# Altium schematic sheet 555_Timer_Schematic.SchDoc
size A3; SheetNumber: 1; SheetTotal: 1
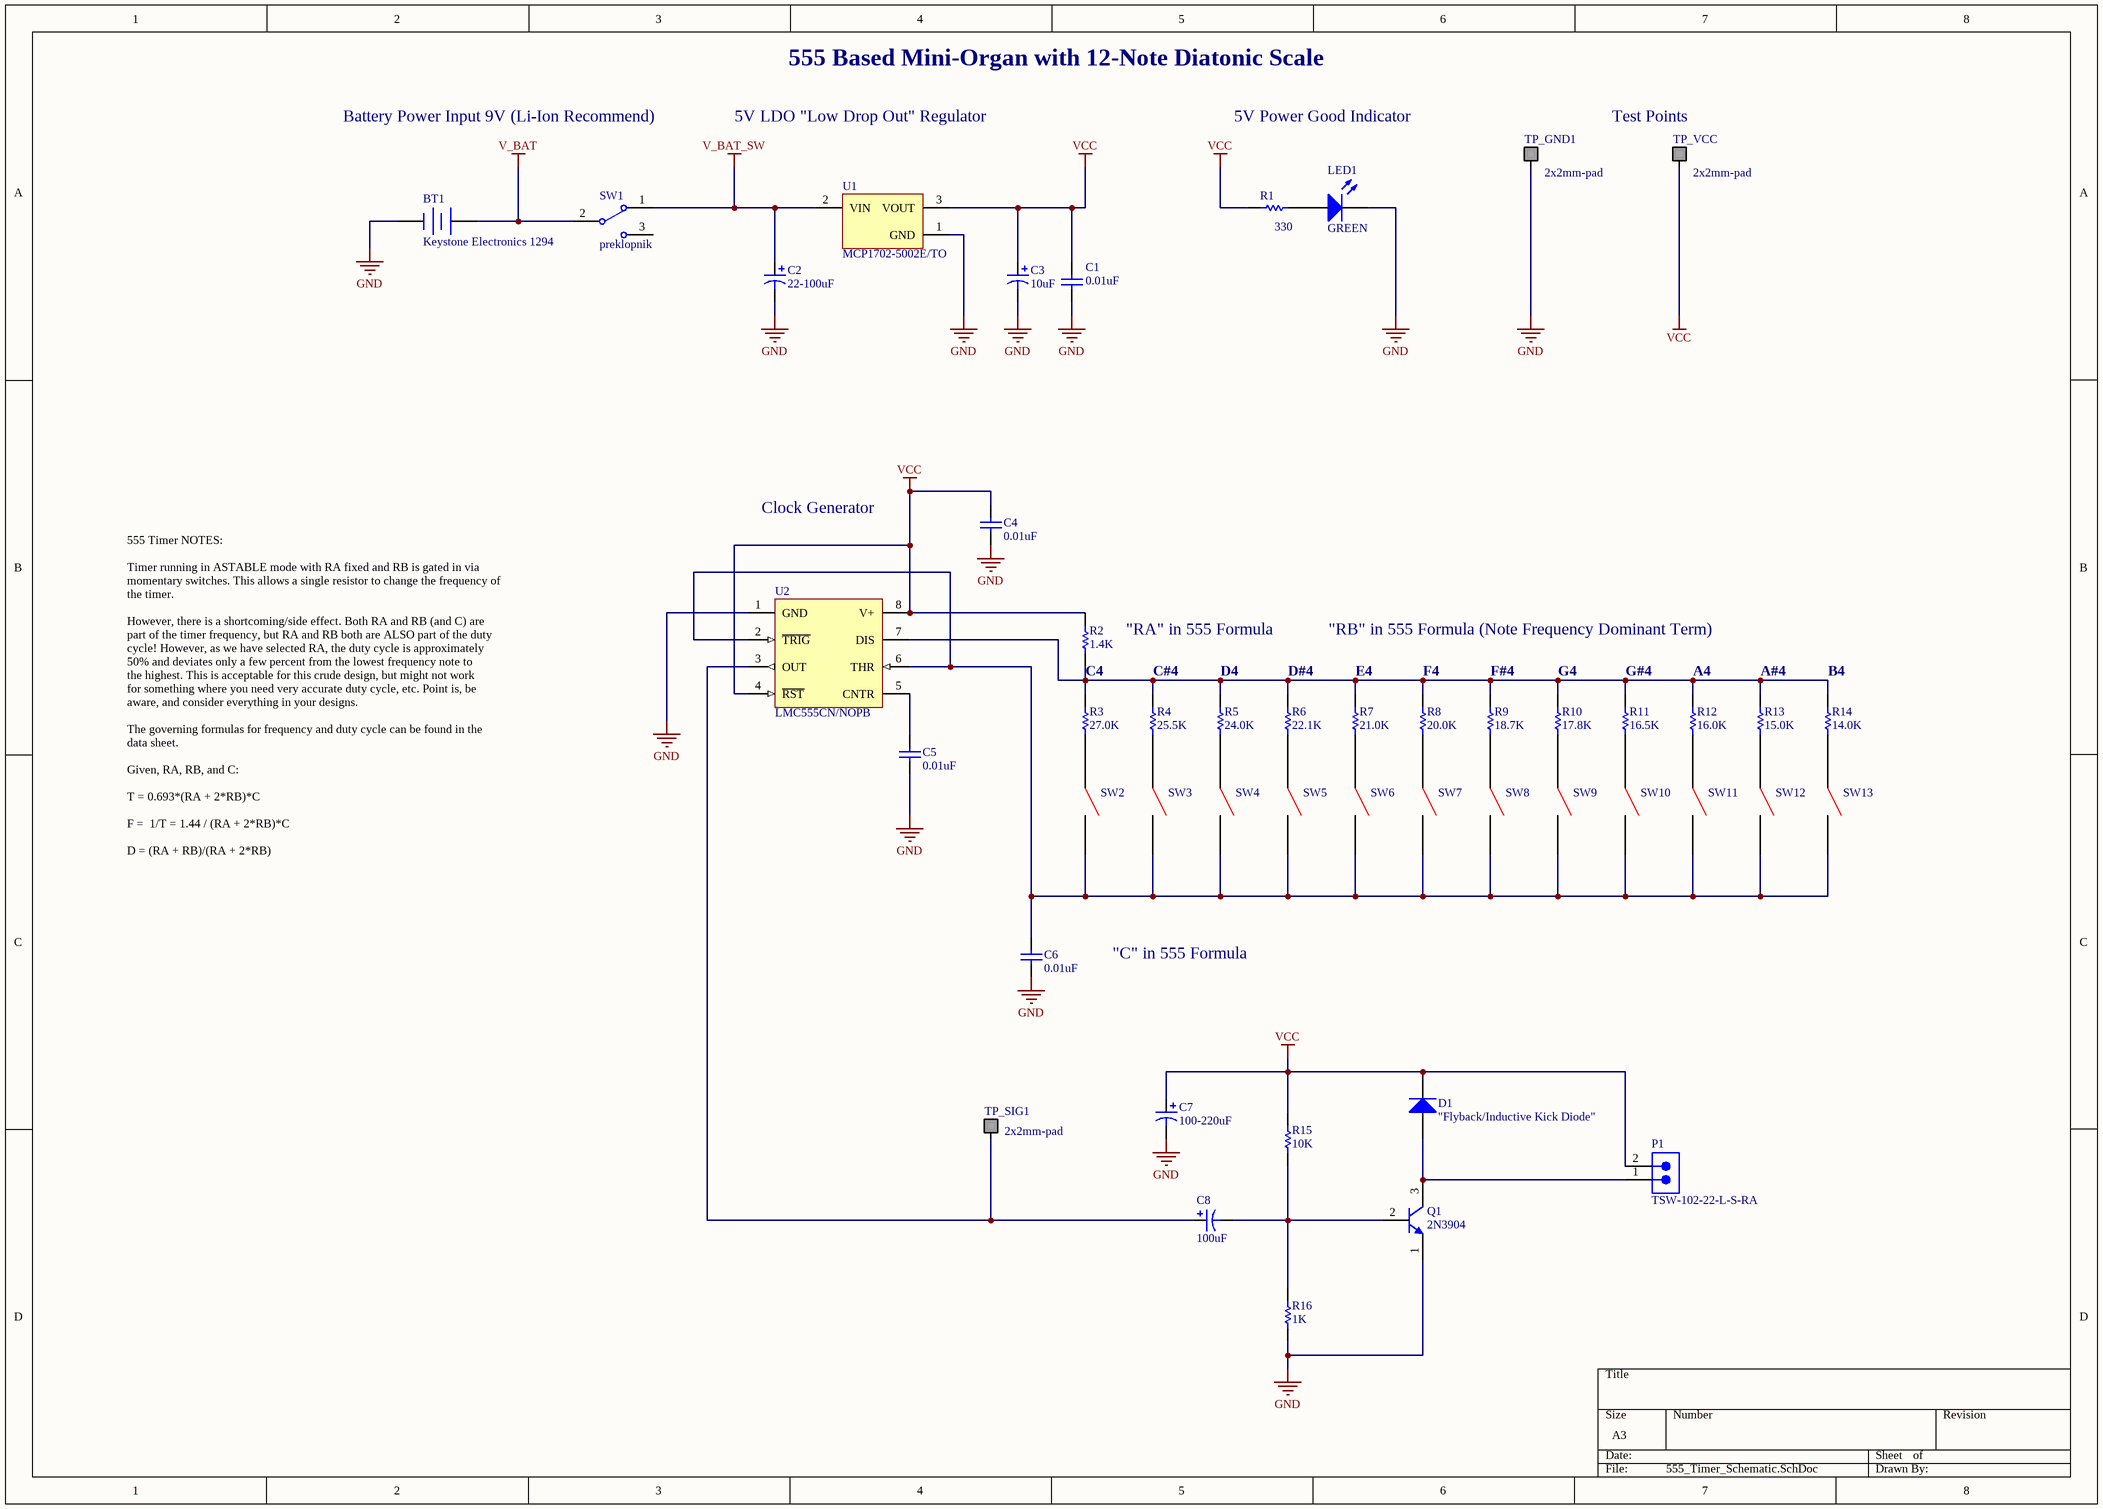
[diagram p0: 555_Timer_Schematic.SchDoc]

## Parts
BT1  Keystone Electronics 1294  [PCB-3798-1]
C1  0.01uF  [PCB-l4zci1ynknckpo24ombh-1]
C2  22-100uF  [PCB-xswzn1jk2ejoevwvaoxh-1]
C3  10uF  [PCB-xswzn1jk2ejoevwvaoxh-1]
C4  0.01uF  [PCB-l4zci1ynknckpo24ombh-1]
C5  0.01uF  [PCB-l4zci1ynknckpo24ombh-1]
C6  0.01uF  [PCB-l4zci1ynknckpo24ombh-1]
C7  100-220uF  [PCB-xswzn1jk2ejoevwvaoxh-1]
C8  100uF  [PCB-xswzn1jk2ejoevwvaoxh-1]
D1  "Flyback/Inductive Kick Diode"  [PCB-m243dhbzbg0yyf6dq86g-1]
LED1  GREEN  [PCB-teu6t62n2bsx7jl1if62-1]
P1  TSW-102-22-L-S-RA  [SMTC-TSW-102-22-X-S-RA]
Q1  2N3904  [PCB-z2fqeret6inh8n7vzy86-1]
R1  330  [PCB-bfjjg625tt0lscyu35rt-1]
R2  1.4K  [PCB-bfjjg625tt0lscyu35rt-1]
R3  27.0K  [PCB-bfjjg625tt0lscyu35rt-1]
R4  25.5K  [PCB-bfjjg625tt0lscyu35rt-1]
R5  24.0K  [PCB-bfjjg625tt0lscyu35rt-1]
R6  22.1K  [PCB-bfjjg625tt0lscyu35rt-1]
R7  21.0K  [PCB-bfjjg625tt0lscyu35rt-1]
R8  20.0K  [PCB-bfjjg625tt0lscyu35rt-1]
R9  18.7K  [PCB-bfjjg625tt0lscyu35rt-1]
R10  17.8K  [PCB-bfjjg625tt0lscyu35rt-1]
R11  16.5K  [PCB-bfjjg625tt0lscyu35rt-1]
R12  16.0K  [PCB-bfjjg625tt0lscyu35rt-1]
R13  15.0K  [PCB-bfjjg625tt0lscyu35rt-1]
R14  14.0K  [PCB-bfjjg625tt0lscyu35rt-1]
R15  10K  [PCB-bfjjg625tt0lscyu35rt-1]
R16  1K  [PCB-bfjjg625tt0lscyu35rt-1]
SW1  preklopnik  [ESWI-EG1218_V]
SW2  Panasonic EVQ-21405R  [PCB-je10m8m3eogq13l465bo-1]  (value not drawn)
SW3  Panasonic EVQ-21405R  [PCB-je10m8m3eogq13l465bo-1]  (value not drawn)
SW4  Panasonic EVQ-21405R  [PCB-je10m8m3eogq13l465bo-1]  (value not drawn)
SW5  Panasonic EVQ-21405R  [PCB-je10m8m3eogq13l465bo-1]  (value not drawn)
SW6  Panasonic EVQ-21405R  [PCB-je10m8m3eogq13l465bo-1]  (value not drawn)
SW7  Panasonic EVQ-21405R  [PCB-je10m8m3eogq13l465bo-1]  (value not drawn)
SW8  Panasonic EVQ-21405R  [PCB-je10m8m3eogq13l465bo-1]  (value not drawn)
SW9  Panasonic EVQ-21405R  [PCB-je10m8m3eogq13l465bo-1]  (value not drawn)
SW10  Panasonic EVQ-21405R  [PCB-je10m8m3eogq13l465bo-1]  (value not drawn)
SW11  Panasonic EVQ-21405R  [PCB-je10m8m3eogq13l465bo-1]  (value not drawn)
SW12  Panasonic EVQ-21405R  [PCB-je10m8m3eogq13l465bo-1]  (value not drawn)
SW13  Panasonic EVQ-21405R  [PCB-je10m8m3eogq13l465bo-1]  (value not drawn)
TP_GND1  2x2mm-pad  [PCB-iek5qk9ganu4yn12lo6h-1]
TP_SIG1  2x2mm-pad  [PCB-iek5qk9ganu4yn12lo6h-1]
TP_VCC  2x2mm-pad  [PCB-iek5qk9ganu4yn12lo6h-1]
U1  MCP1702-5002E/TO  [TO-92-TO3]
U2  LMC555CN/NOPB  [N08E]

## Nets
GND: BT1.2(-) C1.2 C2.- C3.- C4.2 C5.2 C6.2 C7.- LED1.1(K) Q1.1(E) R16.1 TP_GND1.1 U1.1(GND) U2.1(GND)
V_BAT: BT1.1(+) SW1.2(COM)
V_BAT_SW: C2.+ SW1.1 U1.2(VIN)
VCC: C1.1 C3.+ C4.1 C7.+ D1.2(K) P1.2 R1.2 R2.2 R15.2 TP_VCC.1 U1.3(VOUT) U2.4(~{RST}) U2.8(V+)
NetC5_1: C5.1 U2.5(CNTR)
NetC6_1: C6.1 SW2.2 SW3.2 SW4.2 SW5.2 SW6.2 SW7.2 SW8.2 SW9.2 SW10.2 SW11.2 SW12.2 SW13.2 U2.2(~{TRIG}) U2.6(THR)
NetC8_+: C8.+ TP_SIG1.1 U2.3(OUT)
NetC8_-: C8.- Q1.2(B) R15.1 R16.2
NetD1_1: D1.1(A) P1.1 Q1.3(C)
NetLED1_2: LED1.2(A) R1.1
NetR2_1: R2.1 R3.2 R4.2 R5.2 R6.2 R7.2 R8.2 R9.2 R10.2 R11.2 R12.2 R13.2 R14.2 U2.7(DIS)
NetR3_1: R3.1 SW2.1
NetR4_1: R4.1 SW3.1
NetR5_1: R5.1 SW4.1
NetR6_1: R6.1 SW5.1
NetR7_1: R7.1 SW6.1
NetR8_1: R8.1 SW7.1
NetR9_1: R9.1 SW8.1
NetR10_1: R10.1 SW9.1
NetR11_1: R11.1 SW10.1
NetR12_1: R12.1 SW11.1
NetR13_1: R13.1 SW12.1
NetR14_1: R14.1 SW13.1

Not connected (* = marked no-connect by the designer): SW1 3

## Notes on the sheet
- 555 Based Mini-Organ with 12-Note Diatonic Scale
- Battery Power Input 9V (Li-Ion Recommend)
- 5V LDO "Low Drop Out" Regulator
- 5V Power Good Indicator
- (near TP_VCC) Test Points
- Clock Generator
- (near R2) "RA" in 555 Formula
- "RB" in 555 Formula (Note Frequency Dominant Term)
- (near R2) C4
- (near R4) C#4
- (near R5) D4
- (near R6) D#4
- (near R7) E4
- (near R8) F4
- (near R9) F#4
- (near R10) G4
- (near R11) G#4
- (near R12) A4
- (near R13) A#4
- (near R14) B4
- 555 Timer NOTES:
  Timer running in ASTABLE mode with RA fixed and RB is gated in via momentary switches. This allows a single resistor to change the frequency of the timer.
  However, there is a shortcoming/side effect. Both RA and RB (and C) are
  part of the timer frequency, but RA and RB both are ALSO part of the duty
  cycle! However, as we have selected RA, the duty cycle is approximately
  50% and deviates only a few percent from the lowest frequency note to
  the highest. This is acceptable for this crude design, but might not work
  for something where you need very accurate duty cycle, etc. Point is, be
  aware, and consider everything in your designs.
  The governing formulas for frequency and duty cycle can be found in the
  data sheet.
  Given, RA, RB, and C:
  T = 0.693*(RA + 2*RB)*C
  F =  1/T = 1.44 / (RA + 2*RB)*C
  D = (RA + RB)/(RA + 2*RB)
- "C" in 555 Formula

## Library data of the parts
BT1 = CMP-3798-6: HOLDER BATT 9V UNIV PLASTIC PC; Manufacturer Part Number: 1294; Number of Contacts: 2; Lead-Free Status: Lead Free; Octopart Url: https://octopart.com/1294-keystone-3743; OctopartID: fd44344ed6bd2283; Material: Plastic; Contact Plating: Nickel; RoHS: Compliant; Contact Material: Steel; REACH SVHC Compliance: No SVHC; Packaging: Bulk
C1 C4-C6 = CMP-7d20b42952c2a2e7-2: Capacitor; Ceramic; Cap 0.1 uF; Tol -20, +80%; Vol-Rtg 50 VDC; Radial; Y5V; Tape & Reel; Manufacturer Part Number: K104Z15Y5VF5TL2; Lead Length: 30.0 mm; Capacitance Tolerance: +80/-20%; Lead-Free Status: Contains Lead; Capacitance: 100 nF; Voltage Rating (DC): 50.0 V; Size-Thickness: 2.60 mm; Number of Pins: 2; Packaging: Cut Tape (CT), Tape & Reel (TR); Size-Height: 4.00 mm; Dielectric Characteristic: Y5V; Size-Diameter: 500 µm; Size-Length: 4.00 mm; Size-Width: 4.00 mm; OctopartID: 7d20b42952c2a2e7; Mounting Style: Through Hole; Dielectric Material: Ceramic; RoHS: Compliant; Octopart URL: http://octopart.com/k104z15y5vf5tl2-vishay+bccomponents-199300
C2 C7 C8 = CMP-b868704b0d3c67af-1: Electrolytic capacitor Radial lead 2.5 mm 10 µF 16 V 20 % (Ø) 4 mm Panasonic EEA-GA1C100H 1 pc(s); Voltage Rating (DC): 16.0 V; Capacitance: 10 uF; Capacitance Tolerance: ±20%; Octopart URL: http://octopart.com/eea-ga1c100h-panasonic-19501106; Manufacturer Part Number: EEA-GA1C100H; Size-Height: 7.00 mm; RoHS: Compliant; Lifecycle Status: Not Listed by Manufacturer; Size-Diameter: 4.00 mm; OctopartID: b868704b0d3c67af; Digikey PN: P15787CT-ND; Digikey URL: http://www.digikey.com/product-detail/en/panasonic-electronic-components/EEA-GA1C100H/P15787CT-ND/3831154; Dimension: DxLxF = 4x7x2.5mm
C3 = CMP-b868704b0d3c67af-1: Electrolytic capacitor Radial lead 2.5 mm 10 µF 16 V 20 % (Ø) 4 mm Panasonic EEA-GA1C100H 1 pc(s); Voltage Rating (DC): 16.0 V; Capacitance Tolerance: ±20%; Octopart URL: http://octopart.com/eea-ga1c100h-panasonic-19501106; Manufacturer Part Number: EEA-GA1C100H; Size-Height: 7.00 mm; RoHS: Compliant; Capacitance: 10 uF; Lifecycle Status: Not Listed by Manufacturer; Size-Diameter: 4.00 mm; OctopartID: b868704b0d3c67af; Digikey PN: P15787CT-ND; Digikey URL: http://www.digikey.com/product-detail/en/panasonic-electronic-components/EEA-GA1C100H/P15787CT-ND/3831154; Dimension: DxLxF = 4x7x2.5mm
D1 = 1N4001-TP: 1N4001 Series 1 A 400 V Through-Hole Rectifying Diode - DO-41; Voltage Rating (DC): 50 V; Current Rating: 1 A; Capacitance: 15.0 pF; Lead-Free Status: Lead Free; Polarity: Standard; Packaging: Cut Tape (CT), Tape & Reel (TR); Manufacturer Part Number: 1N4001-TP; Case/Package: DO-41; OctopartID: 504e994f51a98f89; RoHS: Compliant; Octopart URL: http://octopart.com/1n4001-tp-mcc-730241; Mounting Style: Through Hole
LED1 = CMP-92bb5b2eff764d7c-3: LED Uni-Color Green 2-Pin T-1 3/4 Bulk; Manufacturer Part Number: C503B-GCN-CY0C0791; Manufacturer: Cree; Viewing Angle: 30 °; Luminous Intensity: 12.5 cd; Wavelength: 527 nm; Forward Voltage: 3.20 V; RoHS: Compliant; Mounting Style: Through Hole; Octopart URL: http://octopart.com/c503b-gcn-cy0c0791-cree-10438827; Color: Green; OctopartID: 92bb5b2eff764d7c; Number of Pins: 2
P1 = CMP-668697-2: 0.025" SQ Post Header, Through-hole, Right Angle, -55 to 125 degC, 2.54 mm Pitch, 2-Pin, Male, RoHS; Number of Contacts: 2; Pin Pitch: 0.00254 m; Manufacturer Part Number: TSW-102-22-L-S-RA; Contact Material: Phosphor Bronze; Contact Plating: Gold; Gender: Male; Mounting Style: Through Hole; Number of Rows: 1; Octopart Url: https://octopart.com/tsw-102-22-l-s-ra-samtec-11758137; OctopartID: 0b86c23f44d9d441; REACH SVHC Compliance: No SVHC; RoHS: Compliant
Q1 = CMP-f5bd3d62cc5c2a7a-6: Bipolar Transistor, TO-92, 40V, 200mA, NPN; Mounting Style: Through Hole; Manufacturer Part Number: 2N3904; OctopartID: f5bd3d62cc5c2a7a; Octopart Url: https://octopart.com/2n3904-diotec-30743687; RoHS: Compliant; Packaging: Ammo Pack
R1-R16 = CMP-db3e1311f37e04f9-1: Res Carbon Film 1K Ohm 5% 1/4W -400ppm/°C to 0ppm/°C Conformal AXL Thru-Hole T/R; Manufacturer Part Number: CF14JT1K00; Lead-Free Status: Lead Free; Octopart URL: http://octopart.com/cf14jt1k00-stackpole+electronics-19205414; Packaging: Tape & Reel (TR); RoHS: Compliant; Mounting Style: Axial, Through Hole; Resistance Tolerance: ±5%; OctopartID: db3e1311f37e04f9
SW1 = CMP-9a5a5340a2f5459d-18: Slide Switch, 500 V, -20 to 70 degC, 3-Pin THD, RoHS; Manufacturer Part Number: EG1218; Current Rating: 200 mA; Number of Positions: 2; Actuator Type: Standard; Contacts Type: SPDT; Lead-Free Status: Lead Free; DatasheetVersion: Oct-15; Size-Length: 2.03 mm; Size-Height: 5.40 mm; OctopartID: 9a5a5340a2f5459d; PackageDescription: 3-Pin Through Hole Device, Body 11.6 x 4 mm, Pitch 2.5 mm; Contact Plating: Silver; Contact Material: Copper Alloy; Packaging: Bulk; Mounting Style: PCB, Through Hole; Size-Width: 4.00 mm; RoHS: Compliant; PackageReference: EG1218; Seller Landing  Url: https://octopart-clicks.com/click/track?country=US&ak=8157f166&sig=0e9adab&sid=459&ppid=1056201&vpid=1179261&ct=offers; Octopart Url: http://octopart.com/eg1218-e-switch-1056201; Orientation: Vertical
SW2-SW13 = EVQ-21405R: Switch Tactile N.O. SPST Round Button PC Pins 0.02A 15VDC 1.3N Thru-Hole Radial T/R; Element14 Part No.: 2281982; RoHS: Compliant; Size-Width: 6.00 mm; Octopart URL: http://octopart.com/evq-21405r-panasonic-55650591; Size-Length: 6.00 mm; Mounting Style: Through Hole, PC Board
TP_GND1 TP_SIG1 TP_VCC = RCT-0C: Raychem; SMT Circuit probe pad, 0805, 0R0 RCT
U1 = CMP-1493418-2: 250 mA Low Quiescent Current LDO Regulator, 3-Pin TO-92, Extended TemperatureBAG; Dropout Voltage: 0.33 V; Lead-Free Status: Lead Free; Number of Outputs: 1; Output Voltage: 5.0 V; Quiescent Current: 2e-06 A; Manufacturer Part Number: MCP1702-5002E/TO; Case/Package: TO-92; Lifecycle Status: Active; Mounting Style: Through Hole; Number of Pins: 3; Octopart Url: https://octopart.com/mcp1702-5002e%2Fto-microchip-535762; OctopartID: b1707872b8c46eb7; Packaging: Bulk; REACH SVHC Compliance: No SVHC; RoHS: Compliant
U2 = CMP-0056-00025-4: CMOS Timer, 8-pin MDIP, Pb-Free; Frequency: 3000000.0 Hz; Lead-Free Status: Lead Free; Quiescent Current: 5e-05 A; Lifecycle Status: Active; Mounting Style: Through Hole; Number of Pins: 8; Octopart Url: https://octopart.com/lmc555cn%2Fnopb-texas+instruments-24815228; OctopartID: 3409fc79b713ebce; Packaging: Tube; RoHS: Compliant